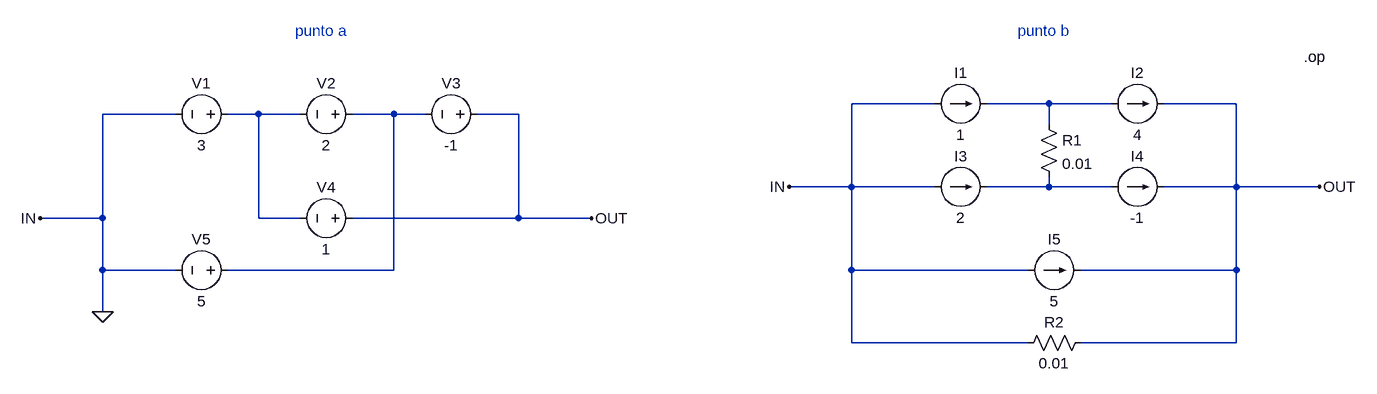
[diagram p0: schematic guia_1A_ej_7.asc]
guia_1A_ej_7.asc, the LTspice schematic file:
Version 4
SHEET 1 880 680
WIRE 144 240 16 240
WIRE 320 240 224 240
WIRE 416 240 320 240
WIRE 608 240 496 240
WIRE -1024 256 -1136 256
WIRE -896 256 -944 256
WIRE -832 256 -896 256
WIRE -688 256 -752 256
WIRE -640 256 -688 256
WIRE -496 256 -560 256
WIRE 320 272 320 240
WIRE 16 368 16 240
WIRE 16 368 -80 368
WIRE 144 368 16 368
WIRE 320 368 320 352
WIRE 320 368 224 368
WIRE 416 368 320 368
WIRE 608 368 608 240
WIRE 608 368 496 368
WIRE 736 368 608 368
WIRE -1136 416 -1136 256
WIRE -1136 416 -1232 416
WIRE -896 416 -896 256
WIRE -832 416 -896 416
WIRE -496 416 -496 256
WIRE -496 416 -752 416
WIRE -384 416 -496 416
WIRE -1136 496 -1136 416
WIRE -1024 496 -1136 496
WIRE -688 496 -688 256
WIRE -688 496 -944 496
WIRE 16 496 16 368
WIRE 288 496 16 496
WIRE 608 496 608 368
WIRE 608 496 368 496
WIRE -1136 560 -1136 496
WIRE 16 608 16 496
WIRE 288 608 16 608
WIRE 608 608 608 496
WIRE 608 608 368 608
FLAG 736 368 OUT
FLAG -80 368 IN
FLAG -384 416 OUT
FLAG -1232 416 IN
FLAG -1136 560 0
SYMBOL current 144 240 R270
WINDOW 0 32 40 VTop 2
WINDOW 3 -32 40 VBottom 2
SYMATTR InstName I1
SYMATTR Value 1
SYMBOL current 416 240 R270
WINDOW 0 32 40 VTop 2
WINDOW 3 -32 40 VBottom 2
SYMATTR InstName I2
SYMATTR Value 4
SYMBOL current 144 368 R270
WINDOW 0 32 40 VTop 2
WINDOW 3 -32 40 VBottom 2
SYMATTR InstName I3
SYMATTR Value 2
SYMBOL current 416 368 R270
WINDOW 0 32 40 VTop 2
WINDOW 3 -32 40 VBottom 2
SYMATTR InstName I4
SYMATTR Value -1
SYMBOL current 288 496 R270
WINDOW 0 32 40 VTop 2
WINDOW 3 -32 40 VBottom 2
SYMATTR InstName I5
SYMATTR Value 5
SYMBOL res 304 256 R0
SYMATTR InstName R1
SYMATTR Value 0.01
SYMBOL res 384 592 R90
WINDOW 0 0 56 VBottom 2
WINDOW 3 32 56 VTop 2
SYMATTR InstName R2
SYMATTR Value 0.01
SYMBOL voltage -928 256 R90
WINDOW 0 -32 56 VBottom 2
WINDOW 3 32 56 VTop 2
SYMATTR InstName V1
SYMATTR Value 3
SYMBOL voltage -736 256 R90
WINDOW 0 -32 56 VBottom 2
WINDOW 3 32 56 VTop 2
SYMATTR InstName V2
SYMATTR Value 2
SYMBOL voltage -544 256 R90
WINDOW 0 -32 56 VBottom 2
WINDOW 3 32 56 VTop 2
SYMATTR InstName V3
SYMATTR Value -1
SYMATTR SpiceLine Rser=0.01
SYMBOL voltage -736 416 R90
WINDOW 0 -32 56 VBottom 2
WINDOW 3 32 56 VTop 2
SYMATTR InstName V4
SYMATTR Value 1
SYMBOL voltage -928 496 R90
WINDOW 0 -32 56 VBottom 2
WINDOW 3 32 56 VTop 2
SYMATTR InstName V5
SYMATTR Value 5
SYMATTR SpiceLine Rser=0.01
TEXT 712 168 Left 2 !.op
TEXT -840 128 Left 2 ;punto a
TEXT 272 128 Left 2 ;punto b

The netlist it stands for:
* guia_1A_ej_7.asc
I1 0 N001 1
I2 N001 OUT 4
I3 0 N004 2
I4 N004 OUT -1
I5 0 OUT 5
R1 N001 N004 0.01
R2 OUT 0 0.01
V1 N002 0 3
V2 N003 N002 2
V3 OUT N003 -1 Rser=0.01
V4 OUT N002 1
V5 N003 0 5 Rser=0.01
.op
* punto a
* punto b
.backanno
.end